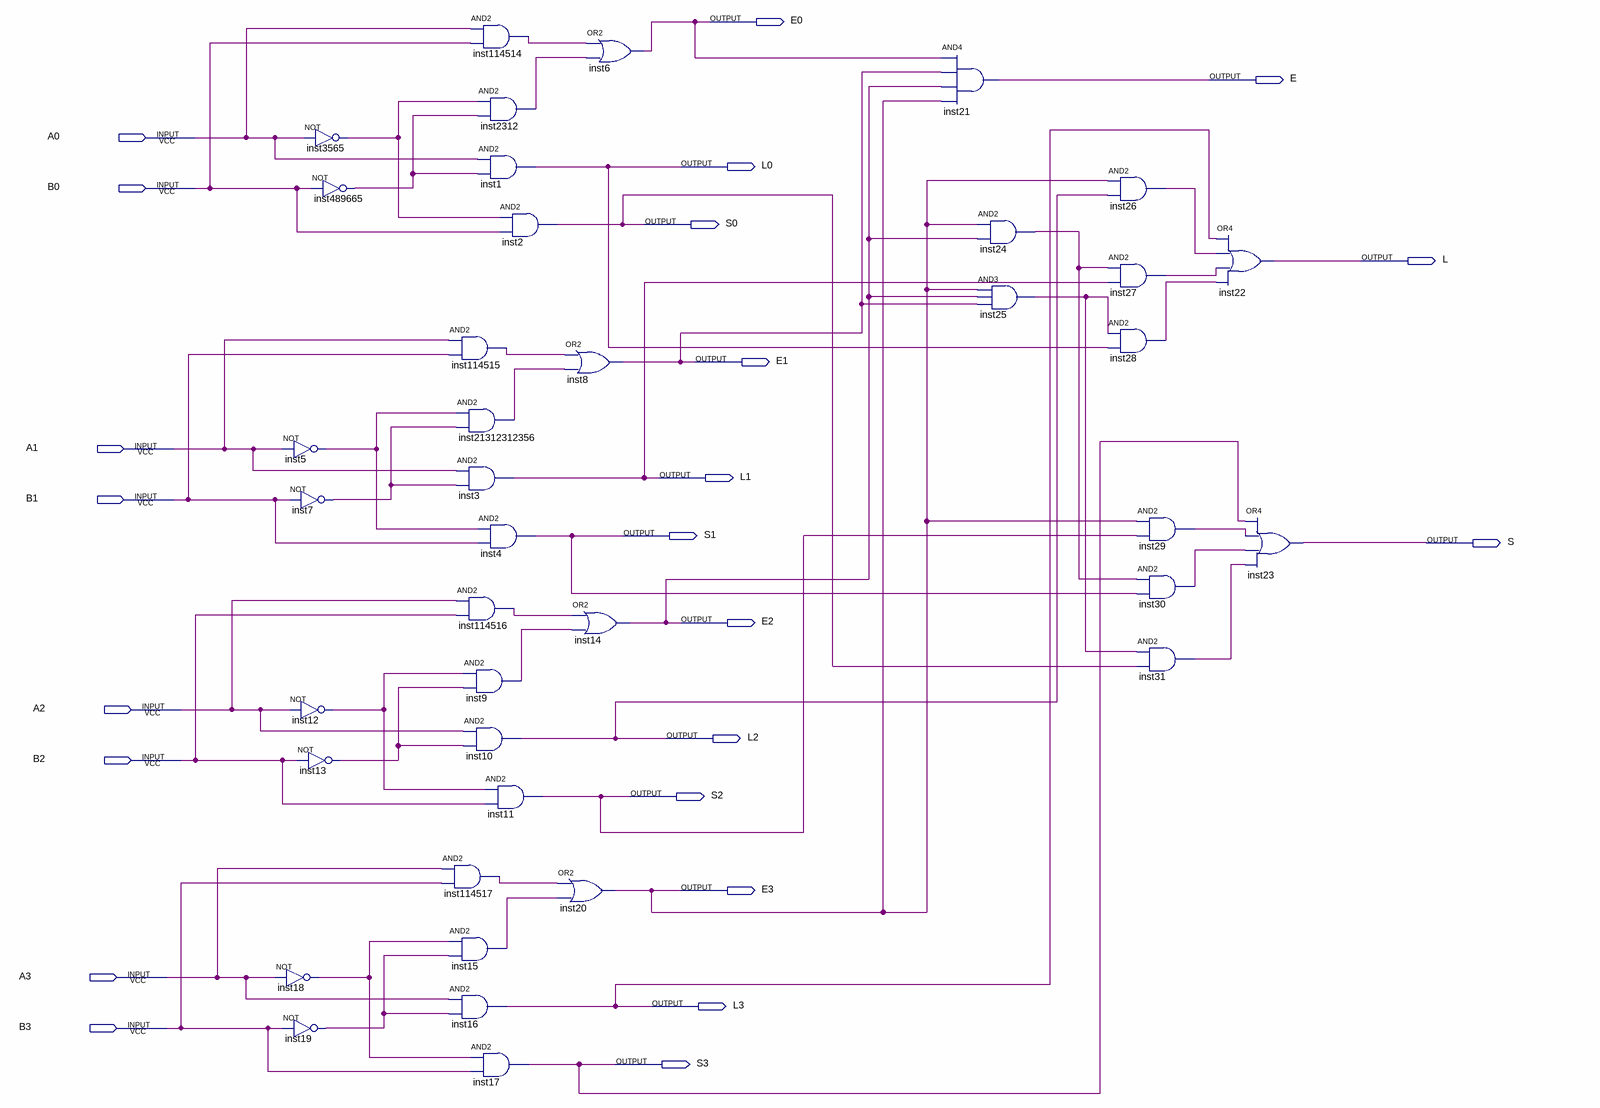
[diagram p0: schematic sheet]
// Quartus schematic fourBitCoparer.bdf as structural Verilog: 39 symbols, 23 pins
module fourBitCoparer (
  input  A0,
  input  B0,
  input  A1,
  input  B1,
  input  A2,
  input  B2,
  input  A3,
  input  B3,
  output E0,
  output E,
  output L0,
  output S0,
  output L,
  output E1,
  output L1,
  output S1,
  output S,
  output E2,
  output L2,
  output S2,
  output E3,
  output L3,
  output S3
);

  wire inst5_out, inst7_out, inst9_out, inst12_out, inst13_out, inst15_out, inst18_out, inst19_out,
       inst24_out, inst25_out, inst26_out, inst27_out, inst28_out, inst29_out, inst30_out, inst31_out,
       inst2312_out, inst3565_out, inst114514_out, inst114515_out, inst114516_out, inst114517_out,
       inst489665_out, inst21312312356_out;

  not inst3565 (inst3565_out, A0);
  not inst5 (inst5_out, A1);
  not inst7 (inst7_out, B1);
  not inst12 (inst12_out, A2);
  not inst13 (inst13_out, B2);
  not inst18 (inst18_out, A3);
  not inst19 (inst19_out, B3);
  not inst489665 (inst489665_out, B0);
  and inst114514 (inst114514_out, A0, B0);
  and inst2312 (inst2312_out, inst3565_out, inst489665_out);
  and inst1 (L0, A0, inst489665_out);
  and inst114515 (inst114515_out, A1, B1);
  and inst21312312356 (inst21312312356_out, inst5_out, inst7_out);
  and inst3 (L1, A1, inst7_out);
  and inst4 (S1, inst5_out, B1);
  and inst114516 (inst114516_out, A2, B2);
  and inst9 (inst9_out, inst12_out, inst13_out);
  and inst10 (L2, A2, inst13_out);
  and inst114517 (inst114517_out, A3, B3);
  and inst15 (inst15_out, inst18_out, inst19_out);
  and inst16 (L3, A3, inst19_out);
  and inst17 (S3, inst18_out, B3);
  and inst2 (S0, inst3565_out, B0);
  and inst11 (S2, inst12_out, B2);
  or inst6 (E0, inst114514_out, inst2312_out);
  or inst8 (E1, inst114515_out, inst21312312356_out);
  or inst14 (E2, inst114516_out, inst9_out);
  or inst20 (E3, inst114517_out, inst15_out);
  and inst21 (E, E0, E1, E2, E3);
  and inst24 (inst24_out, E3, E2);
  and inst25 (inst25_out, E3, E2, E1);
  and inst26 (inst26_out, E3, L2);
  and inst27 (inst27_out, inst24_out, L1);
  and inst28 (inst28_out, inst25_out, L0);
  and inst29 (inst29_out, E3, S2);
  and inst30 (inst30_out, inst24_out, S1);
  and inst31 (inst31_out, inst25_out, S0);
  or inst22 (L, L3, inst26_out, inst27_out, inst28_out);
  or inst23 (S, S3, inst29_out, inst30_out, inst31_out);
endmodule
